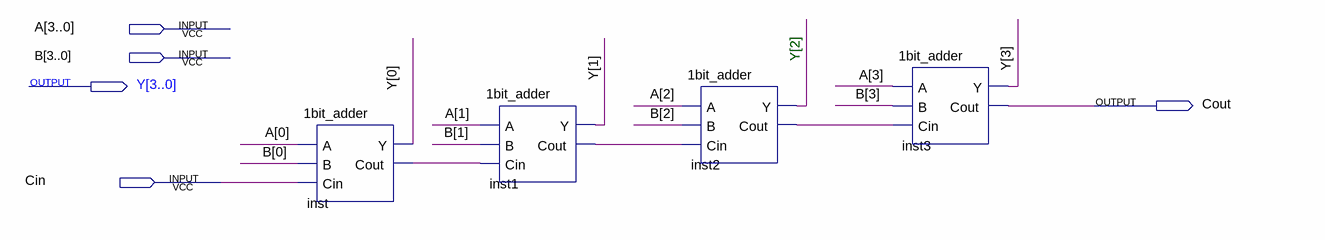
[diagram p0: schematic sheet]
// Quartus schematic 4bit_adder.bdf as structural Verilog: 4 symbols, 5 pins
module \4bit_adder  (
  input  [3:0] A,
  input  [3:0] B,
  input  Cin,
  output [3:0] Y,
  output Cout
);

  wire inst1_cout, inst2_cout, inst_cout;

  \1bit_adder  inst (.A(A[0]), .B(B[0]), .Cin(Cin), .Y(Y[0]), .Cout(inst_cout));
  \1bit_adder  inst1 (.A(A[1]), .B(B[1]), .Cin(inst_cout), .Y(Y[1]), .Cout(inst1_cout));
  \1bit_adder  inst2 (.A(A[2]), .B(B[2]), .Cin(inst1_cout), .Y(Y[2]), .Cout(inst2_cout));
  \1bit_adder  inst3 (.A(A[3]), .B(B[3]), .Cin(inst2_cout), .Y(Y[3]), .Cout(Cout));

  // Notes on the sheet:
  //   Y[2]
endmodule
